# Altium schematic sheet cpu.SchDoc
size A3
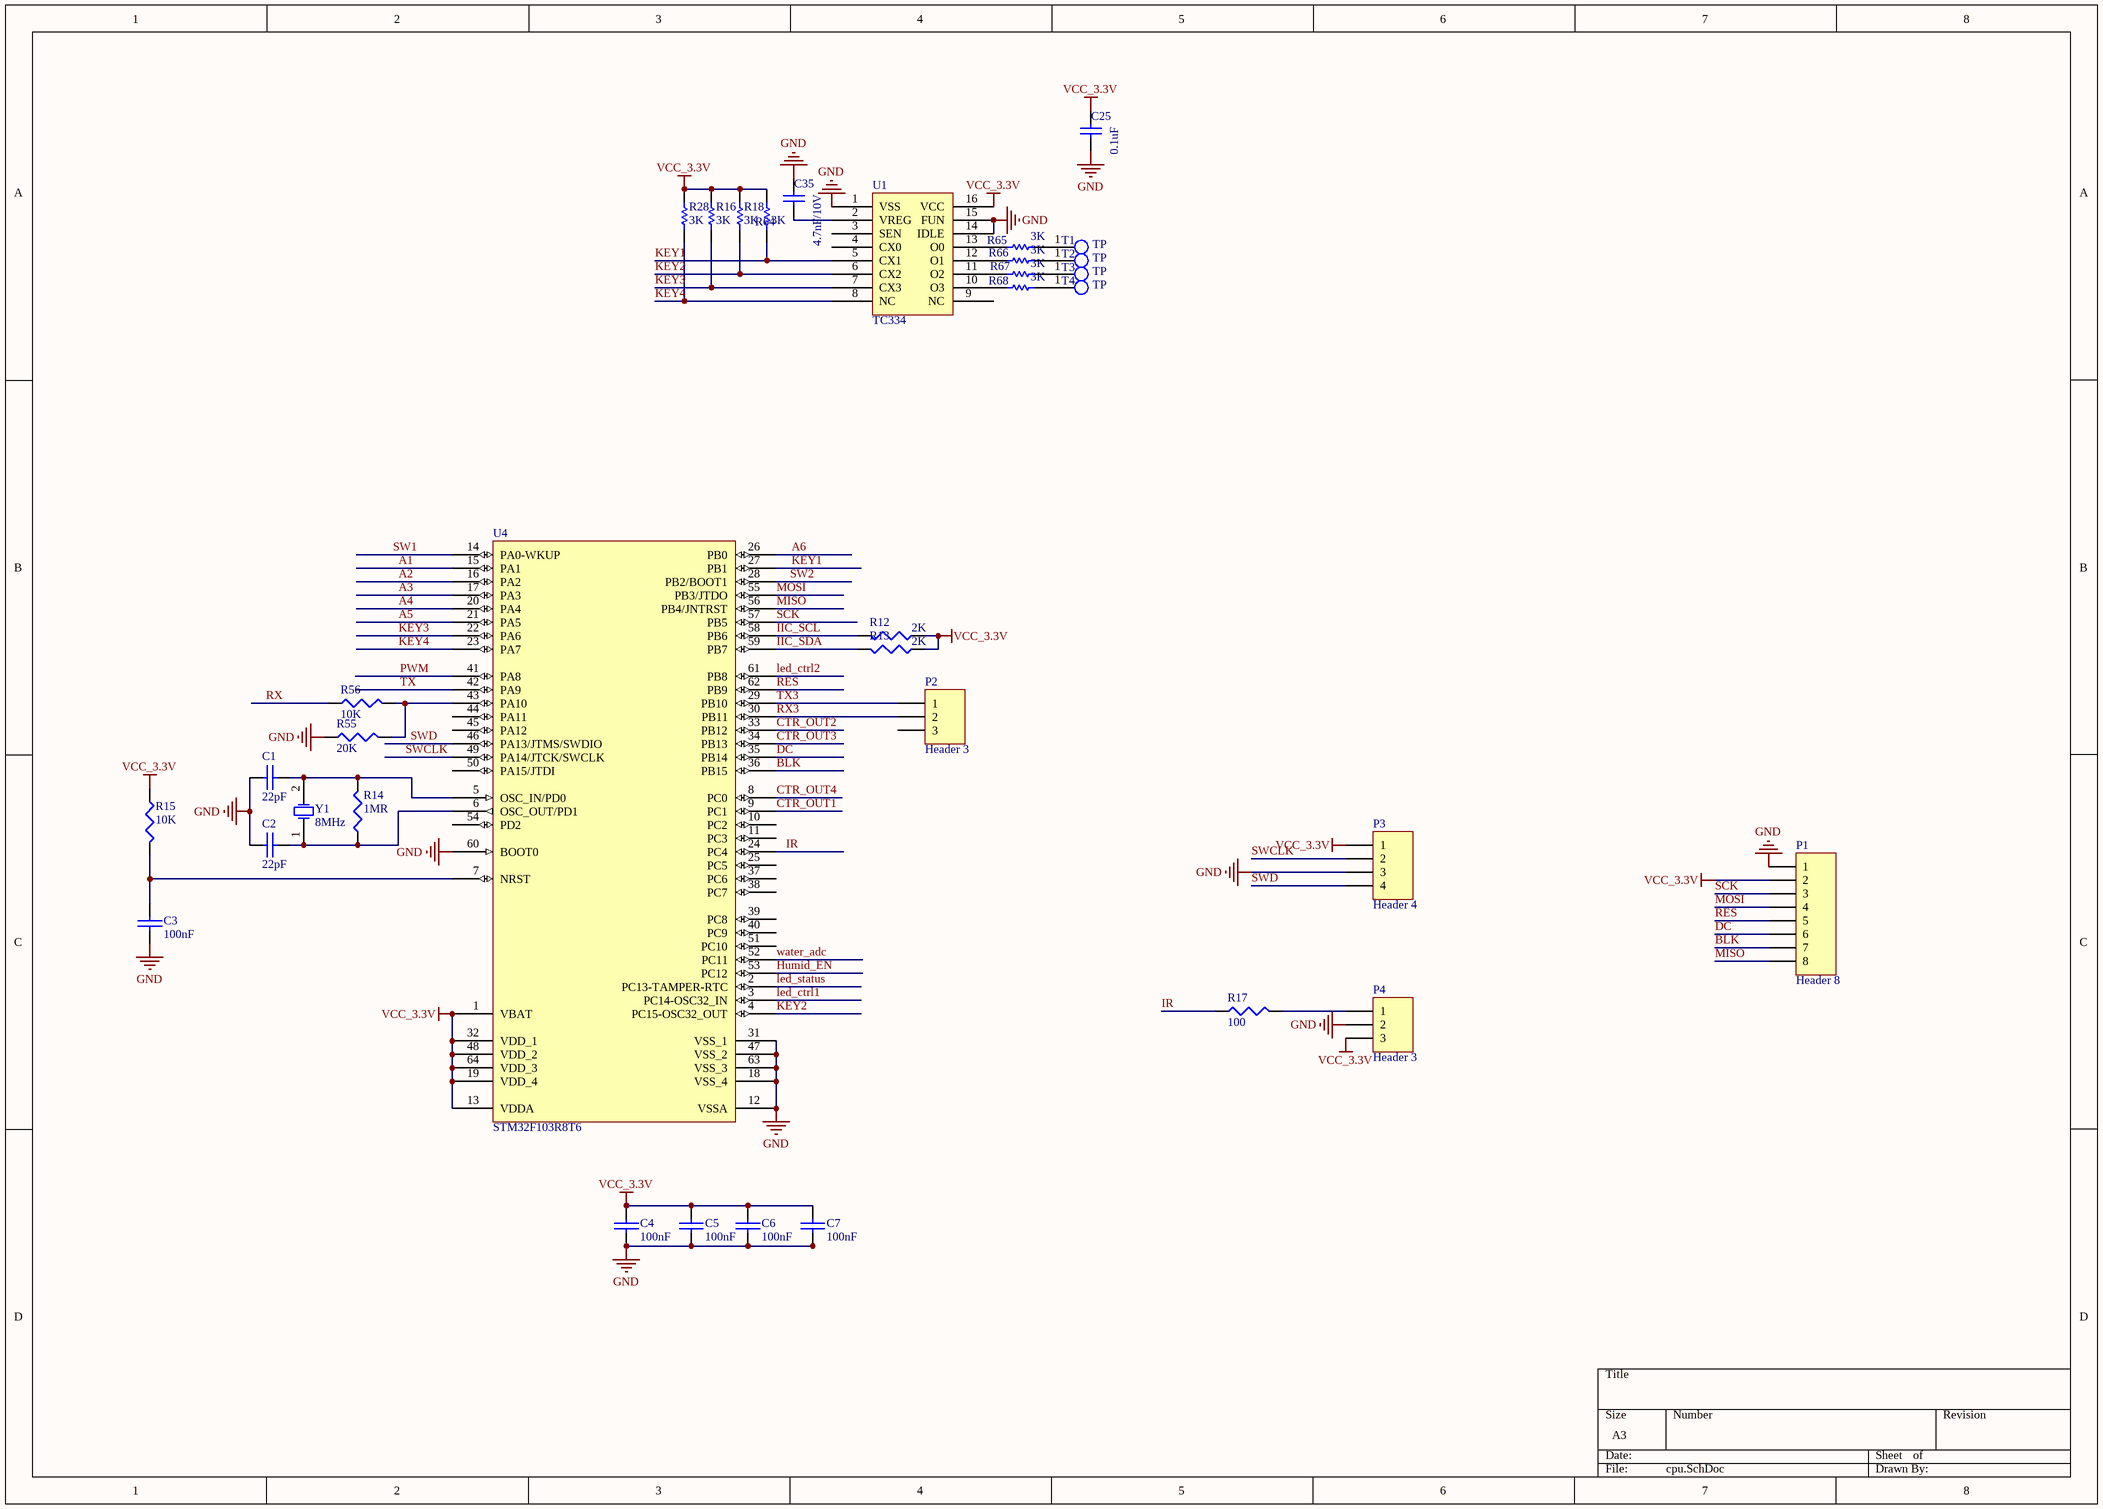
[diagram p0: cpu.SchDoc]

## Parts
C1  22pF  [0805c]
C2  22pF  [0805c]
C3  100nF  [0805c]
C4  100nF  [0805c]
C5  100nF  [0805c]
C6  100nF  [0805c]
C7  100nF  [0805c]
C25  0.1uF  [0603C]
C35  4.7nF/10V  [0603C]
P1  Header 8  [TFT2.4]
P2  Header 3  [HDR1X3]
P3  Header 4  [HDR1X4]
P4  Header 3  [HDR1X3]
R12  2K  [0805R]
R13  2K  [0805R]
R14  1MR  [0805R]
R15  10K  [0805R]
R16  3K  [0603R]
R17  100  [0805R]
R18  3K  [0603R]
R28  3K  [0603R]
R55  20K  [0805R]
R56  10K  [0805R]
R64  3K  [0603R]
R65  3K  [0603R]
R66  3K  [0603R]
R67  3K  [0603R]
R68  3K  [0603R]
T1  TP  [TOUCH-PAD]
T2  TP  [TOUCH-PAD]
T3  TP  [TOUCH-PAD]
T4  TP  [TOUCH-PAD]
U1  TC334  [SOIC127P600X265-16N]
U4  STM32F103R8T6  [LQFP-64]
Y1  8MHz  [SMT5032]

## Nets
GND: C1.1 C2.1 C3.1 C4.1 C5.1 C6.1 C7.1 C25.2 C35.1 P1.1 P3.3 P4.2 R55.1 U1.1(VSS) U1.14(IDLE) U1.15(FUN) U4.12(VSSA) U4.18(VSS_4) U4.31(VSS_1) U4.47(VSS_2) U4.60(BOOT0) U4.63(VSS_3)
VCC_3.3V: C4.2 C5.2 C6.2 C7.2 C25.1 P1.2 P3.1 P4.3 R12.1 R13.1 R15.1 R16.1 R18.1 R28.1 R64.1 U1.16(VCC) U4.1(VBAT) U4.13(VDDA) U4.19(VDD_4) U4.32(VDD_1) U4.48(VDD_2) U4.64(VDD_3)
A1: U4.15(PA1)
A2: U4.16(PA2)
A3: U4.17(PA3)
A4: U4.20(PA4)
A5: U4.21(PA5)
A6: U4.26(PB0)
BLK: P1.7 U4.36(PB15)
CTR_OUT1: U4.9(PC1)
CTR_OUT2: U4.33(PB12)
CTR_OUT3: U4.34(PB13)
CTR_OUT4: U4.8(PC0)
DC: P1.6 U4.35(PB14)
Humid_EN: U4.53(PC12)
IIC_SCL: R12.2 U4.58(PB6)
IIC_SDA: R13.2 U4.59(PB7)
IR: R17.1 U4.24(PC4)
KEY1: R64.2 U1.5(CX1) U4.27(PB1)
KEY2: R18.2 U1.6(CX2) U4.4(PC15-OSC32_OUT)
KEY3: R16.2 U1.7(CX3) U4.22(PA6)
KEY4: R28.2 U1.8(NC) U4.23(PA7)
led_ctrl1: U4.3(PC14-OSC32_IN)
led_ctrl2: U4.61(PB8)
led_status: U4.2(PC13-TAMPER-RTC)
MISO: P1.8 U4.56(PB4/JNTRST)
MOSI: P1.4 U4.55(PB3/JTDO)
PWM: U4.41(PA8)
RES: P1.5 U4.62(PB9)
RX: R56.1
RX3: P2.2 U4.30(PB11)
SCK: P1.3 U4.57(PB5)
SW1: U4.14(PA0-WKUP)
SW2: U4.28(PB2/BOOT1)
SWCLK: P3.2 U4.49(PA14/JTCK/SWCLK)
SWD: P3.4 U4.46(PA13/JTMS/SWDIO)
TX: U4.42(PA9)
TX3: P2.1 U4.29(PB10)
water_adc: U4.52(PC11)
NetC1_2: C1.2 R14.2 U4.5(OSC_IN/PD0) Y1.2(OSC2)
NetC2_2: C2.2 R14.1 U4.6(OSC_OUT/PD1) Y1.1(OSC1)
NetC3_2: C3.2 R15.2 U4.7(NRST)
NetC35_2: C35.2 U1.2(VREG)
NetP4_1: P4.1 R17.2
NetR55_2: R55.2 R56.2 U4.43(PA10)
NetR65_1: R65.1 T1.1
NetR65_2: R65.2 U1.13(O0)
NetR66_1: R66.1 T2.1
NetR66_2: R66.2 U1.12(O1)
NetR67_1: R67.1 T3.1
NetR67_2: R67.2 U1.11(O2)
NetR68_1: R68.1 T4.1
NetR68_2: R68.2 U1.10(O3)

Not connected (* = marked no-connect by the designer): P2 3; U1 3(SEN) 4(CX0) 9(NC); U4 10(PC2) 11(PC3) 25(PC5) 37(PC6) 38(PC7) 39(PC8) 40(PC9) 44(PA11) 45(PA12) 50(PA15/JTDI) 51(PC10) 54(PD2)

## Library data of the parts
C1-C7 = CAP: Capacitor
C25 C35 = Cap: Capacitor; Value: 104; Published: 8-Jun-2000; LatestRevisionDate: 17-Jul-2002; LatestRevisionNote: Re-released for DXP Platform.; PackageReference: RAD-0.3; Publisher: Altium Limited
P1 = Header 8: Header, 8-Pin; LatestRevisionDate: 17-Jul-2002; LatestRevisionNote: Re-released for DXP Platform.; Publisher: Altium Limited
P2 P4 = Header 3: Header, 3-Pin; LatestRevisionDate: 17-Jul-2002; LatestRevisionNote: Re-released for DXP Platform.; Publisher: Altium Limited
P3 = Header 4: Header, 4-Pin; LatestRevisionDate: 17-Jul-2002; LatestRevisionNote: Re-released for DXP Platform.; Publisher: Altium Limited
R12-R15 R17 R55 R56 = Res3: Resistor; Published: 8-Jun-2000; LatestRevisionDate: 29-May-2009; LatestRevisionNote: IPC-7351 Footprint Added.; PackageReference: J1-0603; Publisher: Altium Limited; PackageDescription: Chip Resistor
R16 R18 R28 R64-R68 = Res Semi: Semiconductor Resistor; Value: 1K; Published: 8-Jun-2000; LatestRevisionDate: 17-Jul-2002; LatestRevisionNote: Re-released for DXP Platform.; PackageReference: AXIAL-0.5; Publisher: Altium Limited
U4 = STM32F103R8T6: STM32 ARM-based 32-bit MCU with 64 Kbytes Flash, 64-pin LQFP, Industrial Temperature; Published: 30-May-2008; DatasheetVersion: rev6, Mar-2008; PackageVersion: Mar-2008; PackageReference: LQFP64; Publisher: Altium Limited; PackageDescription: 64-Pin Low-Profile Quad Flat Pack, 10 x 10 mm Body, 0.5 mm Pitch (LQFP64); ComponentLink1Description: Manufacturer Link; ComponentLink1URL: www.st.com/stm32; ComponentLink2Description: Datasheet; ComponentLink2URL: http://www.st.com/stonline/products/literature/ds/13587.pdf
Y1 = XTAL: Crystal Oscillator; Published: 8-Jun-2000; LatestRevisionDate: 17-Jul-2002; LatestRevisionNote: Re-released for DXP Platform.; PackageReference: R38; Publisher: Altium Limited; PackageDescription: Crystal, Thru-Hole; 2 Leads; Body 3.1 x 8.2 mm (Dia.xH)